# Altium schematic sheet Power.SchDoc: Treetap 7C - Power Supply
size A3; Author: Treetap Group; DrawnBy: Treetap Group; Revision: 1; SheetNumber: 3; SheetTotal: 7; PageSetup: Record=PageOptions|CenterHorizontal=True|CenterVertical=True|PrintScale=1.01|XCorrection=1.00|YCorrection=1.00|PrintKind=1|BorderSize=5000000|LeftOffset=0|BottomOffset=0|Orientation=2|PaperLength=1000|PaperWidth=1000|Scale=100|PaperSource=15|PrintQuality=600|MediaType=1|DitherType=10|PaperKind=A3|PrintScaleMode=1
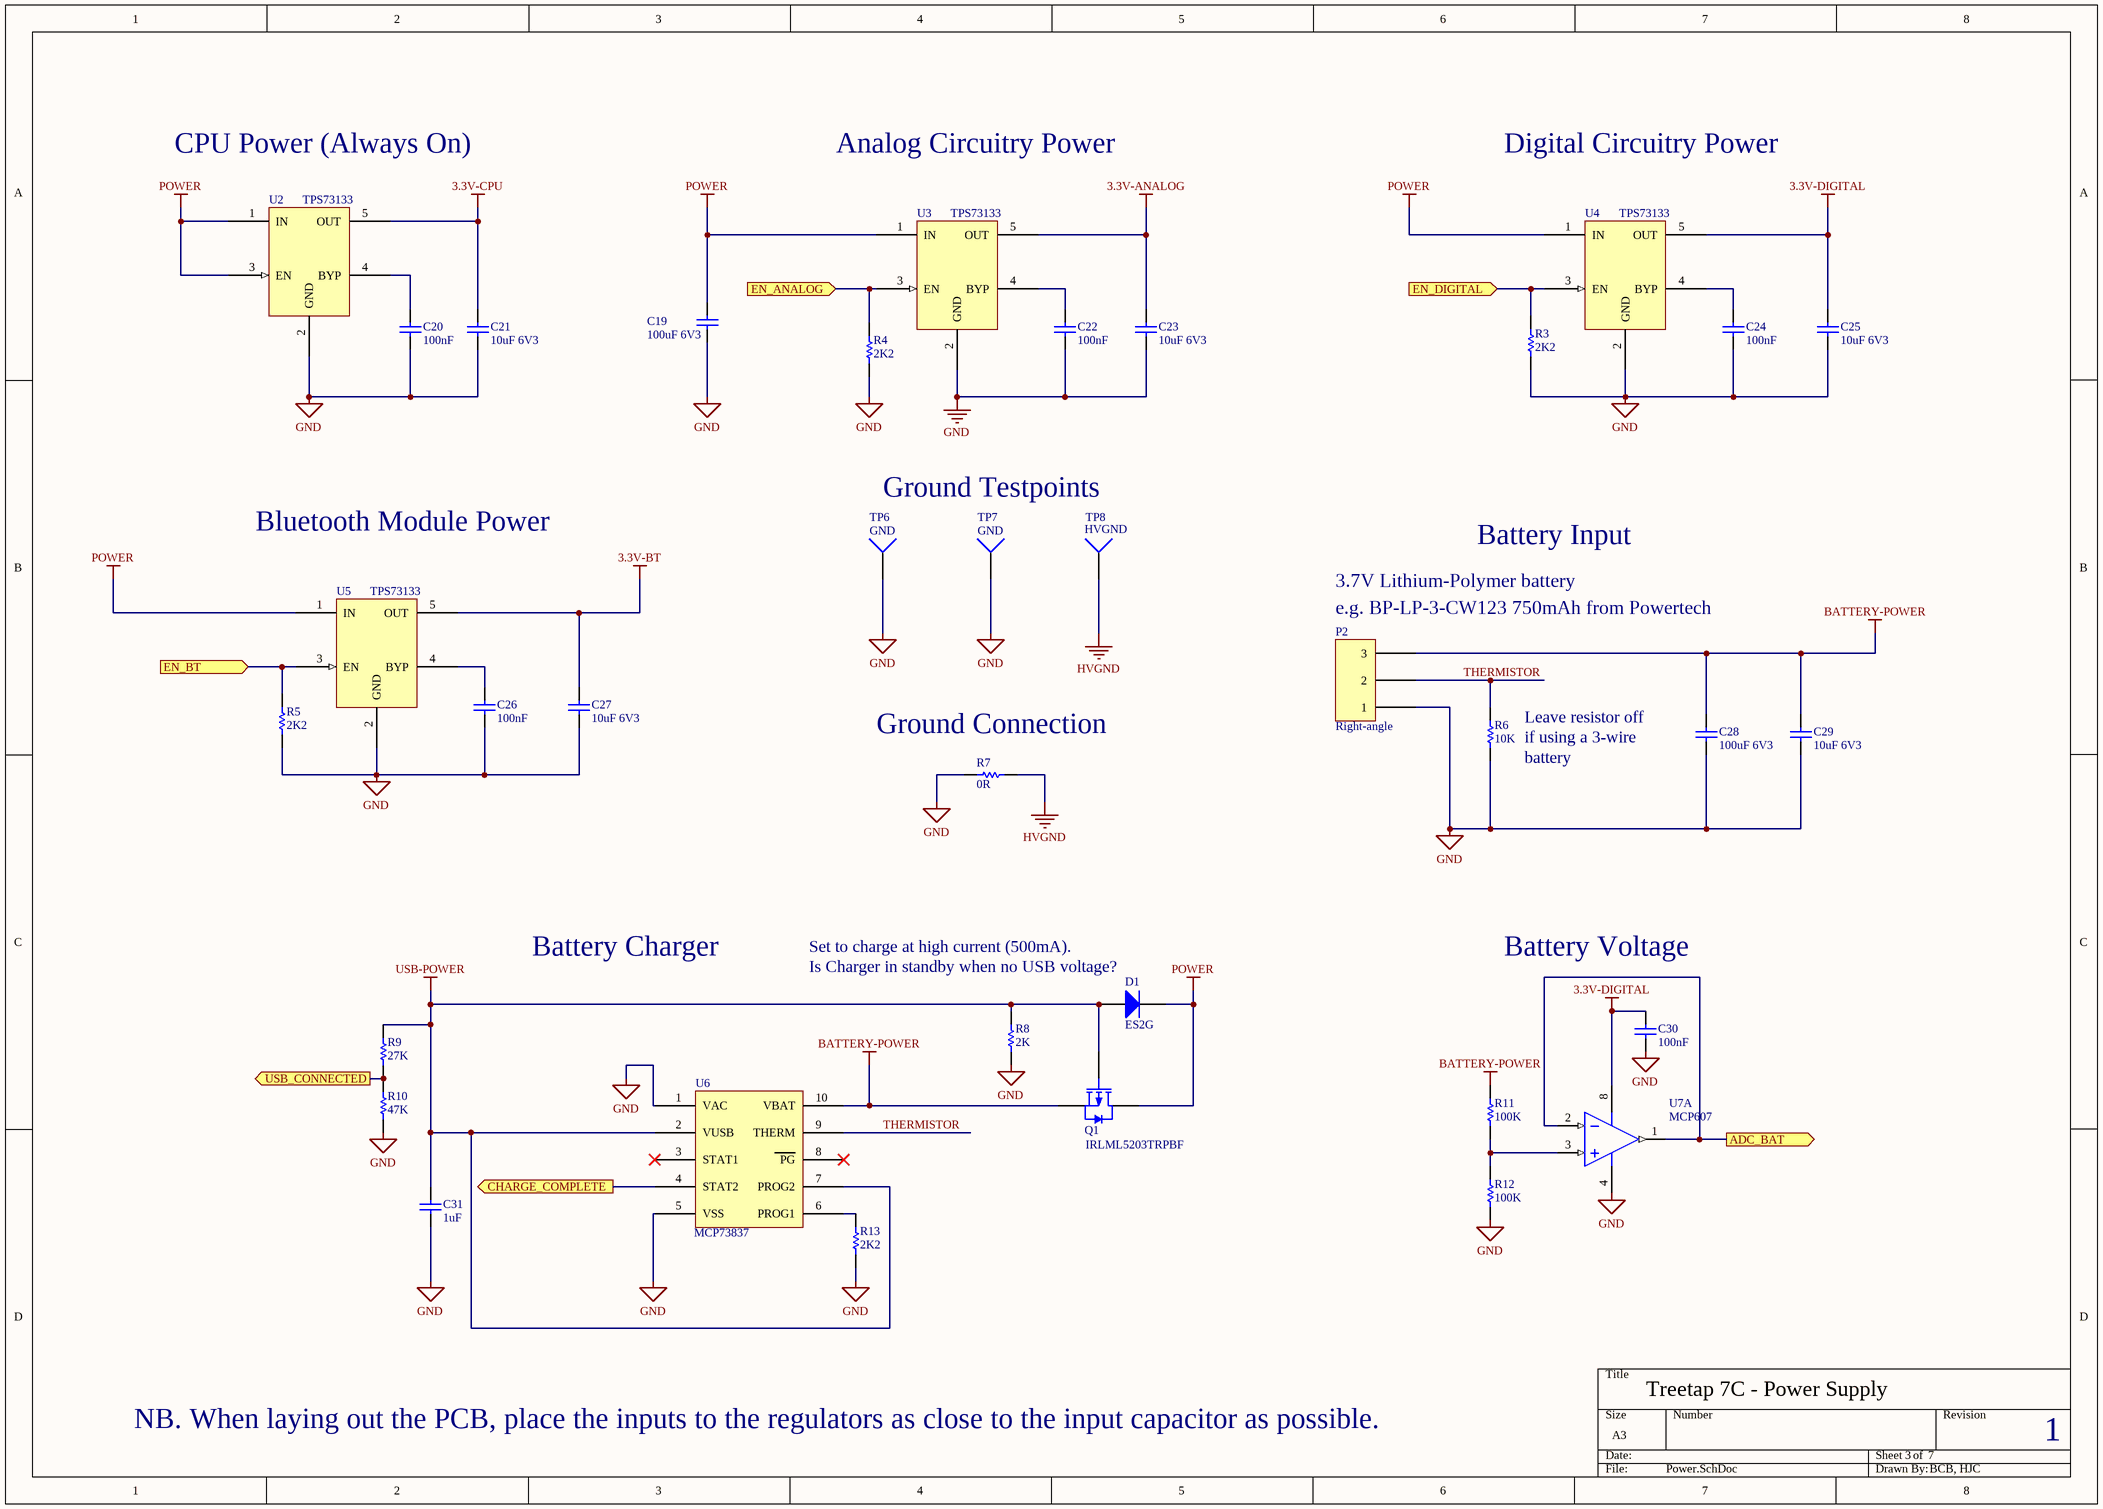
[diagram p0: Power.SchDoc]

## Parts
C19  100uF 6V3  [CC1206]
C20  100nF  [CC0603]
C21  10uF 6V3  [CC0603]
C22  100nF  [CC0603]
C23  10uF 6V3  [CC0603]
C24  100nF  [CC0603]
C25  10uF 6V3  [CC0603]
C26  100nF  [CC0603]
C27  10uF 6V3  [CC0603]
C28  100uF 6V3  [CC1206]
C29  10uF 6V3  [CC0603]
C30  100nF  [CC0603]
C31  1uF  [CC0603]
D1  ES2G  [DO214AA (SMB)]
P2  Right-angle  [3pinheader]
Q1  IRLML5203TRPBF  [SOT-23]
R3  2K2  [R0603]
R4  2K2  [R0603]
R5  2K2  [R0603]
R6  10K  [R0603]
R7  0R  [R0603]
R8  2K  [R0603]
R9  27K  [R0603]
R10  47K  [R0603]
R11  100K  [R0603]
R12  100K  [R0603]
R13  2K2  [R0603]
TP6  GND  [SMTP_1]
TP7  GND  [ThroughHoleTP]
TP8  HVGND  [SMTP_1]
U2  TPS73133  [DBV005]
U3  TPS73133  [DBV005]
U4  TPS73133  [DBV005]
U5  TPS73133  [DBV005]
U6  MCP73837  [10-MSOP]
U7  MCP607  [MS-012]  (part A of 2)

## Ports
ADC_BAT (out), CHARGE_COMPLETE (out), EN_ANALOG (in), EN_BT (in), EN_DIGITAL (in), USB_CONNECTED (out)

## Nets
3.3V-ANALOG: C23.2 U3.5(OUT)
3.3V-BT: C27.2 U5.5(OUT)
3.3V-CPU: C21.2 U2.5(OUT)
3.3V-DIGITAL: C25.2 C30.2 U4.5(OUT) U7.8(V+)
BATTERY-POWER: C28.1 C29.2 P2.3 Q1.3(D) R11.2 U6.10(VBAT)
GND: C19.1 C20.2 C21.1 C22.2 C23.1 C24.2 C25.1 C26.2 C27.1 C28.2 C29.1 C30.1 C31.1 P2.1 R3.1 R4.1 R5.1 R6.1 R7.1 R8.1 R10.1 R12.1 R13.1 TP6.1 TP7.1 U2.2(GND) U3.2(GND) U4.2(GND) U5.2(GND) U6.1(VAC) U6.5(VSS) U7.4(GND)
HVGND: R7.2 TP8.1
POWER: C19.2 D1.2(K) Q1.2(S) U2.1(IN) U2.3(EN) U3.1(IN) U4.1(IN) U5.1(IN)
USB-POWER: C31.2 D1.1(A) Q1.1(G) R8.2 R9.2 U6.2(VUSB) U6.7(PROG2)
ADC_BAT: U7.1(OUT) U7.2(IN-) ; port ADC_BAT
CHARGE_COMPLETE: U6.4(STAT2) ; port CHARGE_COMPLETE
EN_ANALOG: R4.2 U3.3(EN) ; port EN_ANALOG
EN_BT: R5.2 U5.3(EN) ; port EN_BT
EN_DIGITAL: R3.2 U4.3(EN) ; port EN_DIGITAL
THERMISTOR: P2.2 R6.2 U6.9(THERM)
USB_CONNECTED: R9.1 R10.2 ; port USB_CONNECTED
NetC20_1: C20.1 U2.4(BYP)
NetC22_1: C22.1 U3.4(BYP)
NetC24_1: C24.1 U4.4(BYP)
NetC26_1: C26.1 U5.4(BYP)
NetR11_1: R11.1 R12.2 U7.3(IN+)
NetR13_2: R13.2 U6.6(PROG1)

Not connected (* = marked no-connect by the designer): U6 3(STAT1)* 8(PG)*

## Notes on the sheet
- CPU Power (Always On)
- Analog Circuitry Power
- Digital Circuitry Power
- Ground Testpoints
- Bluetooth Module Power
- 3.7V Lithium-Polymer battery
- Battery Input
- (near P2) e.g. BP-LP-3-CW123 750mAh from Powertech
- Leave resistor off
- (near R7) Ground Connection
- if using a 3-wire
- (near R6) battery
- Battery Charger
- Set to charge at high current (500mA).
- (near D1) Is Charger in standby when no USB voltage?
- Battery Voltage
- Treetap 7C - Power Supply
- NB. When laying out the PCB, place the inputs to the regulators as close to the input capacitor as possible.
- 3
- 7
- 1
- BCB, HJC

## Library data of the parts
C19 C28 = 100uF_1206_6V3: 100uF 6.3V 1206 multi-layer ceramic capacitor; Part Number: C1206C107M9PACTU; Manufacturer: Kemet; Supplier_Component_Code: 399-5620-1-ND; published: 08/06/2010; Supplier_Name: Digikey; price: 2.56; Type: Ceramic; value: 100uF 6V3
C20 C22 C24 C26 C30 = 100nF_CC0603: 0603 Capacitor; Supplier_Component_Code: RC-P100; published: 28/03/2007 10:54:57 a.m.; Supplier_Name: Soanar Plus; price: 0.09; value: 100nF; Part Number: 100nF_CC0603; Component Kind: Standard; Component Type: Standard; Designator: 100nF_CC0603; Pin Count: 2
C21 C23 C25 C27 C29 = 10uF_CC0603_6V3: 10uF 6.3V 0603 ceramic capacitor; Manufacturer: Multicomp; Part Number: MCCA000517; Supplier_Component_Code: 1759393; published: 8/06/2010; Supplier_Name: Farnell; price: 0.218; value: 10uF 6V3
C31 = 1uF_0603_25V_ceramic: 1uF 25V 0603 ceramic capacitor; Manufacturer: Kemet; Part Number: C0603C105K3PAC; Order multiple: 10; Pack of: 1; Supplier_Component_Code: 1288202; published: 15/02/2010; Supplier_Name: Farnell; price: 0.465; value: 1uF
D1 = ES2G: Fast 2A 400V SMB diode, Vishay Semiconductor; Manufacturer: Vishay General Semiconductor; Pack of: 1; Order multiple: 5; Supplier_Name: Farnell; Supplier_Component_Code: 1215107; price: 2.32; published: 15/02/2010; value: ES2G; Part Number: ES2G
P2 = 3pinheader: 3 pin 2.54mm pitch right-angle header; Manufacturer: (Multi-sourced part); Pack of: 1; Supplier_Component_Code: HM3423; published: 14/01/2008; Supplier_Name: Soanar Plus; price: 0.18; value: Right-angle; Part Number: -; Order multiple: 1
Q1 = IRLML5203TRPBF: 30V P-channel enhancement mode MOSFET; Manufacturer: International Rectifier; Part Number: IRLML5203PBF; Order multiple: 5; Pack of: 1; Supplier_Name: Farnell; Supplier_Component_Code: 9103511; price: 0.98; published: 15/02/2010; value: IRLML5203TRPBF
R3-R5 R13 = 2K2_R0603: 0603 Resistor; ECE_Component_Code: 2K2_R0603; value: 2K2; Supplier_Component_Code: RS-S081; published: 12/03/2007 11:34:34 a.m.; Supplier_Name: Soanar Plus; price: 0.08; Part Number: 2K2_R0603; Component Kind: Standard; Component Type: Standard; Designator: 2K2_R0603; Pin Count: 2
R6 = 10K_R0603: 0603 Resistor; ECE_Component_Code: 10K_R0603; value: 10K; Supplier_Component_Code: RS-S097; published: 12/03/2007 11:34:34 a.m.; Supplier_Name: Soanar Plus; price: 0.08; Part Number: 10K_R0603; Component Kind: Standard; Component Type: Standard; Designator: 10K_R0603; Pin Count: 2
R7 = 0R_R0603: 0603 Resistor; ECE_Component_Code: 0R_R0603; Supplier_Component_Code: RS-S000; published: 12/03/2007 11:34:33 a.m.; Supplier_Name: Soanar Plus; price: 0.08; value: 0R; Part Number: 0R_R0603; Component Kind: Standard; Component Type: Standard; Designator: 0R_R0603; Pin Count: 2
R8 = 2K_R0603: 0603 Resistor; ECE_Component_Code: 2K_R0603; value: 2K; Supplier_Component_Code: RS-S080; published: 12/03/2007 11:34:34 a.m.; Supplier_Name: Soanar Plus; price: 0.08; Part Number: 2K_R0603; Component Kind: Standard; Component Type: Standard; Designator: 2K_R0603; Pin Count: 2
R9 = 27K_R0603: 0603 Resistor; ECE_Component_Code: 27K_R0603; value: 27K; Supplier_Component_Code: RS-S107; published: 12/03/2007 11:34:34 a.m.; Supplier_Name: Soanar Plus; price: 0.08; Part Number: 27K_R0603; Component Kind: Standard; Component Type: Standard; Designator: 27K_R0603; Pin Count: 2
R10 = 47K_R0603: 0603 Resistor; ECE_Component_Code: 47K_R0603; value: 47K; Supplier_Component_Code: RS-S113; published: 12/03/2007 11:34:34 a.m.; Supplier_Name: Soanar Plus; price: 0.08; Part Number: 47K_R0603; Component Kind: Standard; Component Type: Standard; Designator: 47K_R0603; Pin Count: 2
R11 R12 = 100K_R0603: 0603 Resistor; ECE_Component_Code: 100K_R0603; value: 100K; Supplier_Component_Code: RS-S121; published: 12/03/2007 11:34:34 a.m.; Supplier_Name: Soanar Plus; price: 0.08; Part Number: 100K_R0603; Component Kind: Standard; Component Type: Standard; Designator: 100K_R0603; Pin Count: 2
TP6 TP8 = SMTestPoint: Test point hook (surface mount); Manufacturer: Harwin; Part Number: S1751-46; price: 0.43; published: 15/02/2010; Supplier_Name: Farnell; Supplier_Component_Code: 1022338; value: SMTestPoint
TP7 = ThroughHoleTP: Through hole testpoint - intended for a loop of wire.
U2-U5 = TPS73133: 150mA 3.3V linear regulator with 30mV dropout; Manufacturer: Texas Instruments; Part Number: TPS73133DBVTG4; Pack of: 1; Supplier_Name: Farnell; Supplier_Component_Code: 1207341; price: 0.84; published: 15/02/2010; datasheet_document: http://www.ti.com/lit/gpn/tps73133; value: TPS73133; Order multiple: 1
U6 = MCP73837: USB Lithium Battery Charger; Manufacturer: Microchip; Part Number: MCP73837-FCI/UN; Order multiple: 1; Supplier_Name: Farnell; Supplier_Component_Code: 1675426; price: 1.58; value: MCP73837; Pack of: 1
U7 = MCP607: Dual micropower CMOS opamp; Manufacturer: Microchip; Part Number: MCP607-I/SN; Pack of: 1; datasheet_document: http://ww1.microchip.com/downloads/en/DeviceDoc/11177d.pdf; price: 1.92; Supplier_Name: Farnell; published: 21/12/2007; Supplier_Component_Code: 1196812; value: MCP607; Order multiple: 1